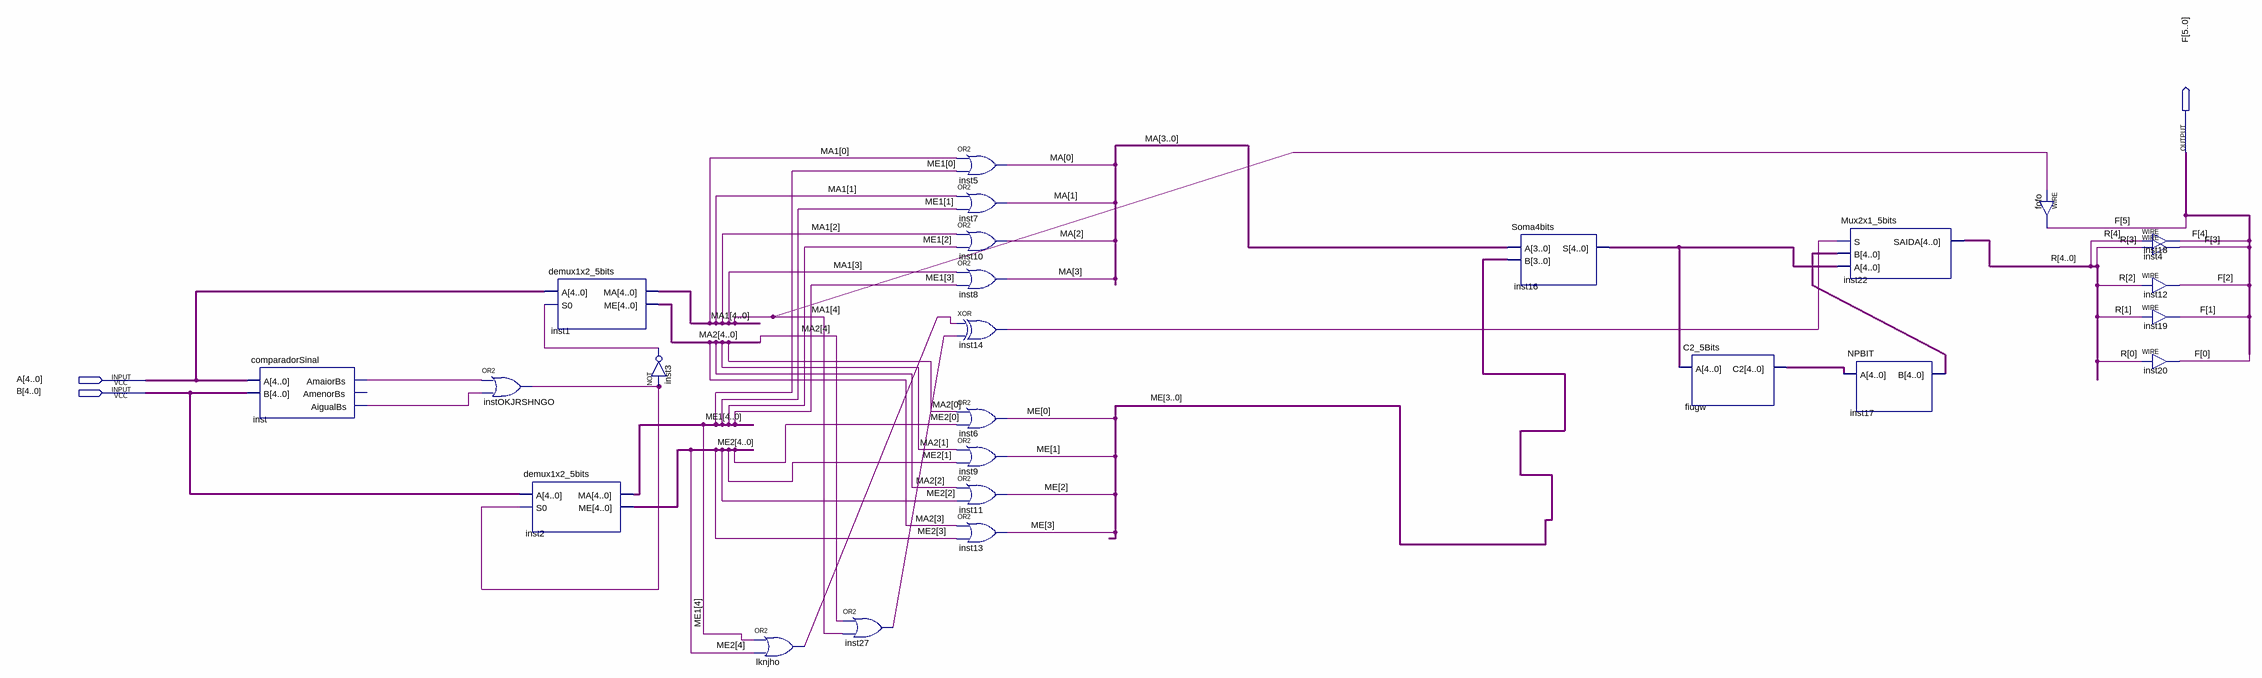
[diagram p0: schematic sheet]
// Quartus schematic somador2v.bdf as structural Verilog: 26 symbols, 3 pins
module somador2v (
  input  [4:0] A,
  input  [4:0] B,
  output [5:0] F
);

  wire inst3_out, inst14_out, inst27_out, inst_aigualbs, inst_amaiorbs, instOKJRSHNGO_out, lknjho_out;
  wire [3:0] MA, ME;
  wire [4:0] fiugw_c2, inst16_s, inst17_b, MA1, MA2, ME1, ME2, R;

  comparadorSinal inst (.A(A), .B(B), .AmaiorBs(inst_amaiorbs), .AigualBs(inst_aigualbs));  // open: AmenorBs
  or instOKJRSHNGO (instOKJRSHNGO_out, inst_amaiorbs, inst_aigualbs);
  demux1x2_5bits inst1 (.A(A), .S0(inst3_out), .MA(MA1), .ME(MA2));
  demux1x2_5bits inst2 (.A(B), .S0(instOKJRSHNGO_out), .MA(ME1), .ME(ME2));
  not inst3 (inst3_out, instOKJRSHNGO_out);
  or lknjho (lknjho_out, ME1[4], ME2[4]);
  or inst27 (inst27_out, MA2[4], MA1[4]);
  or inst5 (MA[0], MA1[0], ME1[0]);
  or inst7 (MA[1], MA1[1], ME1[1]);
  or inst10 (MA[2], MA1[2], ME1[2]);
  or inst8 (MA[3], MA1[3], ME1[3]);
  xor inst14 (inst14_out, lknjho_out, inst27_out);
  or inst6 (ME[0], MA2[0], ME2[0]);
  or inst9 (ME[1], MA2[1], ME2[1]);
  or inst11 (ME[2], MA2[2], ME2[2]);
  or inst13 (ME[3], MA2[3], ME2[3]);
  Soma4bits inst16 (.A(MA), .B(ME), .S(inst16_s));
  C2_5Bits fiugw (.A(inst16_s), .C2(fiugw_c2));
  Mux2x1_5bits inst22 (.S(inst14_out), .B(inst17_b), .A(inst16_s), .SAIDA(R));
  NPBIT inst17 (.A(fiugw_c2), .B(inst17_b));
  assign F[5] = MA1[4];  // WIRE fofo
  assign F[4] = R[4];  // WIRE inst18
  assign F[3] = R[3];  // WIRE inst4
  assign F[2] = R[2];  // WIRE inst12
  assign F[1] = R[1];  // WIRE inst19
  assign F[0] = R[0];  // WIRE inst20
endmodule
